# Altium schematic sheet I2C PinOut.SchDoc: Master I2C PinOut
size A4
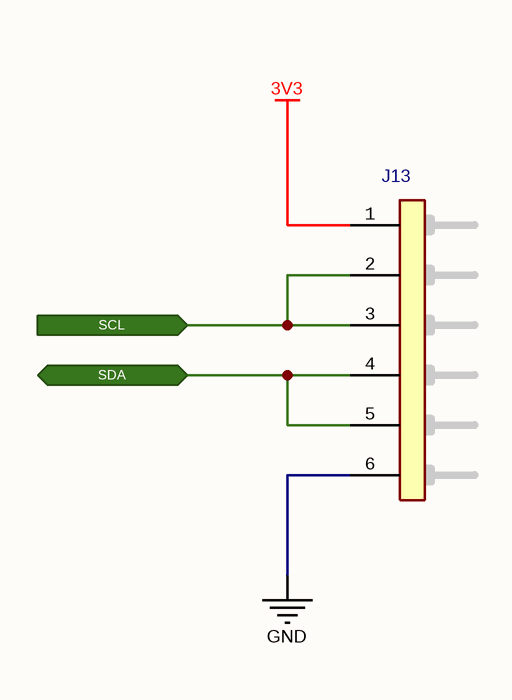
[diagram p0: I2C PinOut.SchDoc]

## Parts
J13  2.54 mm Pitch 6P Male Connector  [6P Header]  (value not drawn)

## Ports
SCL (in), SDA (bidir)

## Nets
3V3: J13.1(Pin-1)
GND: J13.6(Pin-6)
SCL: J13.2(Pin-2) J13.3(Pin-3) ; port SCL
SDA: J13.4(Pin-4) J13.5(Pin-5) ; port SDA

## Notes on the sheet
- Title
- Size:
- Date:
- A4
- Number:
- Time:
- Revision:
- Sheet
- of
- File:

## Library data of the parts
J13 = Connector - Male Header 6P (2.54): Headers & Wire Housings BREAKAWAY HDR VERT 6; Manufacturer Name: Molex; Position: 6; Row: 1; Pitch: 2.54 mm; Manufacturer Part Number: 22-28-4063; Mouser Part Number: 538-22-28-4063; ROHS: Yes; ComponentLink1Description: DataSheet; ComponentLink1URL: https://www.mouser.com.tr/datasheet/2/276/0022284063_PCB_HEADERS-228265.pdf; ComponentLink2Description: Mouser; ComponentLink2URL: https://www.mouser.com.tr/ProductDetail/Molex/22-28-4063?qs=sGAEpiMZZMs%252BGHln7q6pm%252BS0pk2Wo0XxVjxVgqsrZJ8%3D; Supplier 1: Mouser; Supplier 2: Digi-Key; Supplier Part Number 2: WM50016-06-ND; Supplier Part Number 1: 538-22-28-4063